# Altium schematic sheet 07_Misc_2.SchDoc: Misc 2 (part 1 of 2)
size A3; Organization: Lime Microsystems; Address1: Surrey Tech Centre; Address2: Guildford GU2 7YG; Address3: Surrey; Address4: United Kingdom; Revision: v1.0; SheetNumber: 7; SheetTotal: 12
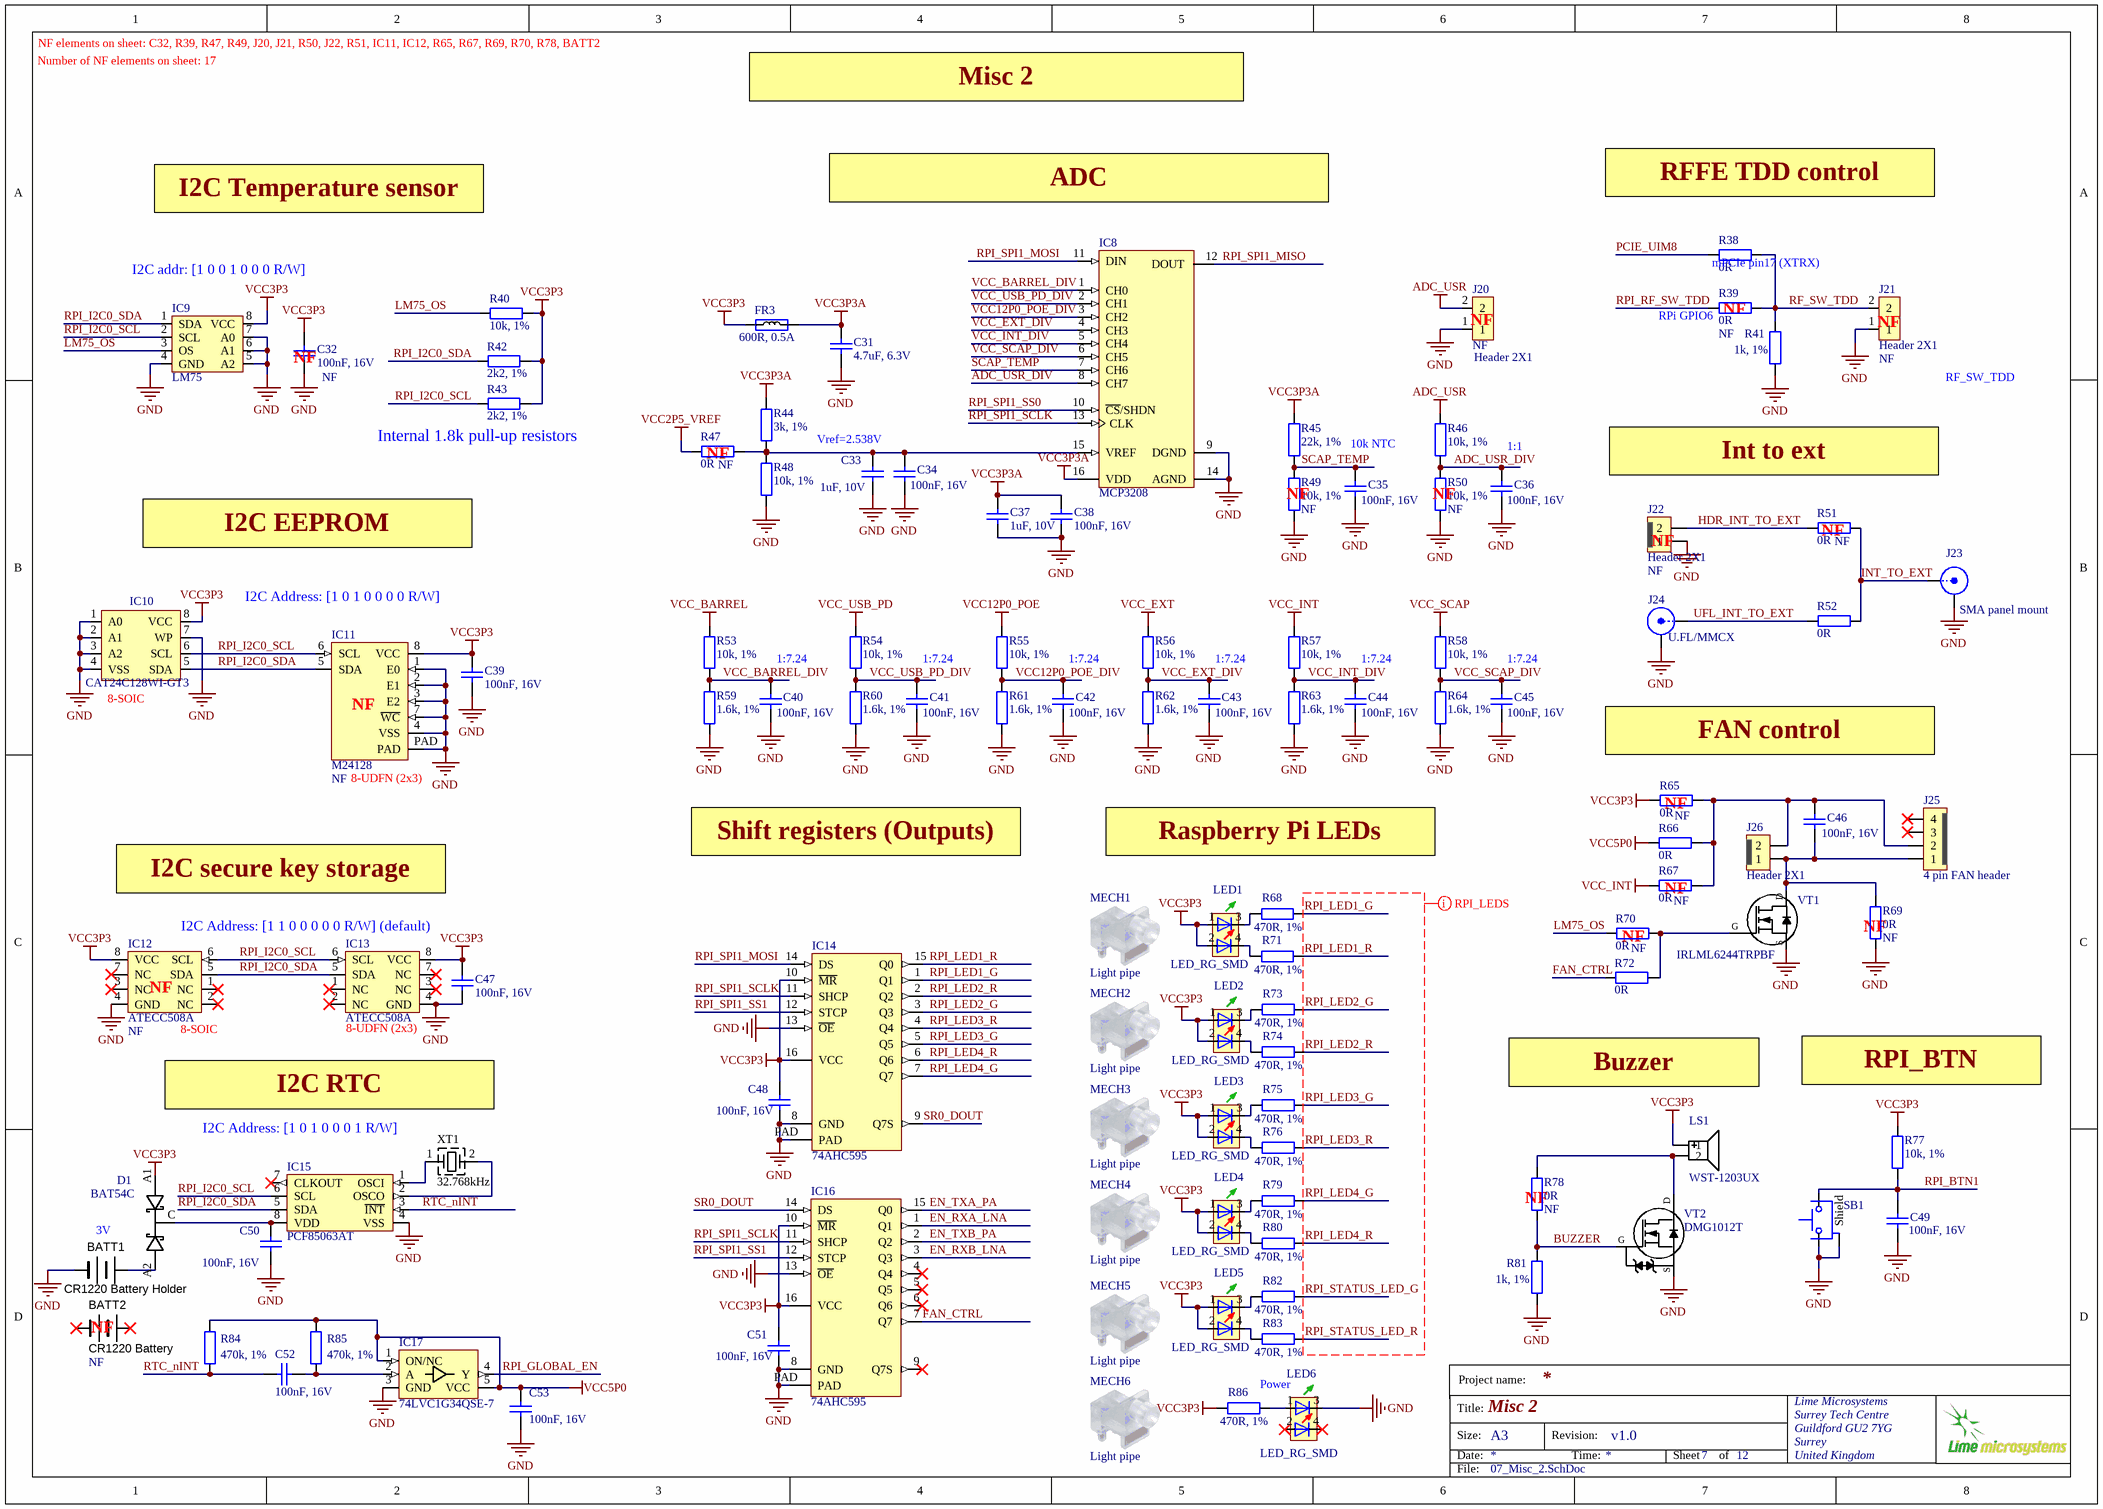
[diagram p0: 07_Misc_2.SchDoc]

## Parts
BATT1  CR1220 Battery Holder  [CR1220_SMD_holder]
BATT2  CR1220 Battery  Assembly Info: NF  (mechanical)
C31  4.7uF, 6.3V  [CAP0402]
C32  100nF, 16V  Assembly Info: NF  [CAP0402]
C33  1uF, 10V  [CAP0402]
C34  100nF, 16V  [CAP0402]
C35  100nF, 16V  [CAP0402]
C36  100nF, 16V  [CAP0402]
C37  1uF, 10V  [CAP0402]
C38  100nF, 16V  [CAP0402]
C39  100nF, 16V  [CAP0402]
C40  100nF, 16V  [CAP0402]
C41  100nF, 16V  [CAP0402]
C42  100nF, 16V  [CAP0402]
C43  100nF, 16V  [CAP0402]
C44  100nF, 16V  [CAP0402]
C45  100nF, 16V  [CAP0402]
C46  100nF, 16V  [CAP0402]
C47  100nF, 16V  [CAP0402]
C48  100nF, 16V  [CAP0402]
C49  100nF, 16V  [CAP0402]
C50  100nF, 16V  [CAP0402]
C51  100nF, 16V  [CAP0402]
C52  100nF, 16V  [CAP0402]
C53  100nF, 16V  [CAP0402]
D1  BAT54C  [BAT54C_SOT23-3]
FR3  600R, 0.5A  [RES0402]
IC8  MCP3208  [MCP3208-CI/SL_SOIC16]
IC9  LM75  [HWSON8_LM75]
IC10  CAT24C128WI-GT3  [SOIC127P600-8DL_v2]
IC11  M24128  Assembly Info: NF  [M24128-DFMC6TG]
IC12  ATECC508A  Assembly Info: NF  [SOIC127P600-8DL_v2]
IC13  ATECC508A  [ATECC508A_UDFN8]
IC14  74AHC595  [74HC595BQ,115]
IC15  PCF85063AT  [PCF85063AT_RTC_SOIC-8]
IC16  74AHC595  [74HC595BQ,115]
IC17  74LVC1G34QSE-7  [74AHCT1G126SE-7_BUFFER_SOT353]
J20  Header 2X1  Assembly Info: NF  [HDR_1x2]
J21  Header 2X1  Assembly Info: NF  [HDR_1x2]
J22  Header 2X1  Assembly Info: NF  [Header1x2_TH_LOCKING]
J23  SMA panel mount  [SMA_connector_side]
J24  U.FL/MMCX  [MMCX_UFL_conn_u]
J25  4 pin FAN header  [Header1x4_TH_LOCKING_v2]
J26  Header 2X1  [Header1x2_TH_LOCKING]
LED1  LED_RG_SMD  [LED-2x0603]
LED2  LED_RG_SMD  [LED-2x0603]
LED3  LED_RG_SMD  [LED-2x0603]
LED4  LED_RG_SMD  [LED-2x0603]
LED5  LED_RG_SMD  [LED-2x0603]
LED6  LED_RG_SMD  [LED-2x0603]
LS1  WST-1203UX  [BUZZER_WST-1203UX]
MECH1  Light pipe  [LIGHT_PIPE_RIGHT_ANGLE_SLP3-200-100-F]
MECH2  Light pipe  [LIGHT_PIPE_RIGHT_ANGLE_SLP3-200-100-F]
MECH3  Light pipe  [LIGHT_PIPE_RIGHT_ANGLE_SLP3-200-100-F]
MECH4  Light pipe  [LIGHT_PIPE_RIGHT_ANGLE_SLP3-200-100-F]
MECH5  Light pipe  [LIGHT_PIPE_RIGHT_ANGLE_SLP3-200-100-F]
MECH6  Light pipe  [LIGHT_PIPE_RIGHT_ANGLE_SLP3-200-100-F]
R38  0R  [RES0402]
R39  0R  Assembly Info: NF  [RES0402]
R40  10k, 1%  [RES0402]
R41  1k, 1%  [RES0402]
R42  2k2, 1%  [RES0402]
R43  2k2, 1%  [RES0402]
R44  3k, 1%  [RES0402]
R45  22k, 1%  [RES0402]
R46  10k, 1%  [RES0402]
R47  0R  Assembly Info: NF  [RES0402_v2]
R48  10k, 1%  [RES0402]
R49  10k, 1%  Assembly Info: NF  [RES0402]
R50  10k, 1%  Assembly Info: NF  [RES0402]
R51  0R  Assembly Info: NF  [RES0402_v2]
R52  0R  [RES0402_v2]
R53  10k, 1%  [RES0402]
R54  10k, 1%  [RES0402]
R55  10k, 1%  [RES0402]
R56  10k, 1%  [RES0402]
R57  10k, 1%  [RES0402]
R58  10k, 1%  [RES0402]
R59  1.6k, 1%  [RES0402]
R60  1.6k, 1%  [RES0402]
R61  1.6k, 1%  [RES0402]
R62  1.6k, 1%  [RES0402]
R63  1.6k, 1%  [RES0402]
R64  1.6k, 1%  [RES0402]
R65  0R  Assembly Info: NF  [RES0402]
R66  0R  [RES0402]
R67  0R  Assembly Info: NF  [RES0402]
R68  470R, 1%  [RES0402]
R69  0R  Assembly Info: NF  [RES0402]
R70  0R  Assembly Info: NF  [RES0402]
R71  470R, 1%  [RES0402]
R72  0R  [RES0402]
R73  470R, 1%  [RES0402]
R74  470R, 1%  [RES0402]
R75  470R, 1%  [RES0402]
R76  470R, 1%  [RES0402]
R77  10k, 1%  [RES0402]
R78  0R  Assembly Info: NF  [RES0402]
R79  470R, 1%  [RES0402]
R80  470R, 1%  [RES0402]
R81  1k, 1%  [RES0402]
R82  470R, 1%  [RES0402]
R83  470R, 1%  [RES0402]
R84  470k, 1%  [RES0402]
R85  470k, 1%  [RES0402]
R86  470R, 1%  [RES0402]
SB1  Switch tactile right edge  [SW_TACTILE_RIGHT_EDGE]  (value not drawn)
VT1  IRLML6244TRPBF  [SOT23-3]
VT2  DMG1012T  [SOT523]
XT1  32.768kHz  [CRYSTAL_2PIN_RTC_RT3215]

## Nets
ADC_USR: J20.2 R46.1
GND: BATT1.NEGATIVE C31.1 C32.2 C33.1 C34.2 C35.2 C36.2 C37.1 C38.1 C39.2 C40.2 C41.2 C42.2 C43.2 C44.2 C45.2 C47.2 C48.1 C49.2 C50.2 C51.1 C53.2 IC8.9(DGND) IC8.14(AGND) IC9.4(GND) IC9.5(A2) IC9.6(A1) IC9.7(A0) IC10.1(A0) IC10.2(A1) IC10.3(A2) IC10.4(VSS) IC10.7(WP) IC11.1(E0) IC11.2(E1) IC11.3(E2) IC11.4(VSS) IC11.7(~{WC}) IC11.PAD IC12.4(GND) IC13.4(GND) IC14.8(GND) IC14.13(~{OE}) IC14.PAD IC15.4(VSS) IC16.8(GND) IC16.13(~{OE}) IC16.PAD IC17.3(GND) J20.1 J21.1 J22.1 J23.2(Y) J24.2(Y) LED6.3 R41.2 R48.2 R49.2 R50.2 R59.1 R60.1 R61.1 R62.1 R63.1 R64.1 R69.1 R81.2 SB1.2 SB1.Shield VT1.S VT2.S
VCC2P5_VREF: R47.1
VCC3P3: C32.1 C39.1 C47.1 C48.2 C51.2 D1.A1 FR3.1 IC9.8(VCC) IC10.8(VCC) IC11.8(VCC) IC12.8(VCC) IC13.8(VCC) IC14.10(~{MR}) IC14.16(VCC) IC16.10(~{MR}) IC16.16(VCC) LED1.1 LED1.2 LED2.1 LED2.2 LED3.1 LED3.2 LED4.1 LED4.2 LED5.1 LED5.2 LS1.1 R40.2 R42.2 R43.2 R65.1 R77.1 R86.2
VCC3P3A: C31.2 C37.2 C38.2 FR3.2 IC8.16(VDD) R44.2 R45.1
VCC5P0: C53.1 IC17.1(ON/NC) IC17.5(VCC) R66.1 R84.2 R85.2
VCC12P0_POE: R55.1
VCC_BARREL: R53.1
VCC_EXT: R56.1
VCC_INT: R57.1 R67.1
VCC_SCAP: R58.1
VCC_USB_PD: R54.1
ADC_USR_DIV: C36.1 IC8.8(CH7) R46.2 R50.1
BUZZER: R78.1 R81.1 VT2.G
EN_RXA_LNA: IC16.1(Q1)
EN_RXB_LNA: IC16.3(Q3)
EN_TXA_PA: IC16.15(Q0)
EN_TXB_PA: IC16.2(Q2)
FAN_CTRL: IC16.7(Q7) R72.1
HDR_INT_TO_EXT: J22.2 R51.2
INT_TO_EXT: J23.1(X) R51.1 R52.1
LM75_OS: IC9.3(OS) R40.1 R70.1
PCIE_UIM8: R38.2
RF_SW_TDD: J21.2 R38.1 R39.1 R41.1
RPI_BTN1: C49.1 R77.2 SB1.1
RPI_GLOBAL_EN: IC17.4(Y)
RPI_I2C0_SCL: IC9.2(SCL) IC10.6(SCL) IC11.6(SCL) IC12.6(SCL) IC13.6(SCL) IC15.6(SCL) R43.1
RPI_I2C0_SDA: IC9.1(SDA) IC10.5(SDA) IC11.5(SDA) IC12.5(SDA) IC13.5(SDA) IC15.5(SDA) R42.1
RPI_LED1_G: IC14.1(Q1) R68.1
RPI_LED1_R: IC14.15(Q0) R71.1
RPI_LED2_G: IC14.3(Q3) R73.1
RPI_LED2_R: IC14.2(Q2) R74.1
RPI_LED3_G: IC14.5(Q5) R75.1
RPI_LED3_R: IC14.4(Q4) R76.1
RPI_LED4_G: IC14.7(Q7) R79.1
RPI_LED4_R: IC14.6(Q6) R80.1
RPI_RF_SW_TDD: R39.2
RPI_SPI1_MISO: IC8.12(DOUT)
RPI_SPI1_MOSI: IC8.11(DIN) IC14.14(DS)
RPI_SPI1_SCLK: IC8.13(CLK) IC14.11(SHCP) IC16.11(SHCP)
RPI_SPI1_SS0: IC8.10(~{CS}/SHDN)
RPI_SPI1_SS1: IC14.12(STCP) IC16.12(STCP)
RPI_STATUS_LED_G: R82.1
RPI_STATUS_LED_R: R83.1
RTC_nINT: C52.1 IC15.3(~{INT}) R84.1
SCAP_TEMP: C35.1 IC8.7(CH6) R45.2 R49.1
SR0_DOUT: IC14.9(Q7S) IC16.14(DS)
UFL_INT_TO_EXT: J24.1(X) R52.2
VCC12P0_POE_DIV: C42.1 IC8.3(CH2) R55.2 R61.2
VCC_BARREL_DIV: C40.1 IC8.1(CH0) R53.2 R59.2
VCC_EXT_DIV: C43.1 IC8.4(CH3) R56.2 R62.2
VCC_INT_DIV: C44.1 IC8.5(CH4) R57.2 R63.2
VCC_SCAP_DIV: C45.1 IC8.6(CH5) R58.2 R64.2
VCC_USB_PD_DIV: C41.1 IC8.2(CH1) R54.2 R60.2
NetBATT1_POSITIVE: BATT1.POSITIVE D1.A2
NetC33_2: C33.2 C34.1 IC8.15(VREF) R44.1 R47.2 R48.1
NetC46_1: C46.1 J25.2 J26.2 R65.2 R66.2 R67.2
NetC46_2: C46.2 J25.1 J26.1 R69.2 VT1.D
NetC50_1: C50.1 D1.C IC15.8(VDD)
NetC52_2: C52.2 IC17.2(A) R85.1
NetIC15_1: IC15.1(OSCI) XT1.1(X)
NetIC15_2: IC15.2(OSCO) XT1.2(X)
NetLED1_3: LED1.3 R68.2
NetLED1_4: LED1.4 R71.2
NetLED2_3: LED2.3 R73.2
NetLED2_4: LED2.4 R74.2
NetLED3_3: LED3.3 R75.2
NetLED3_4: LED3.4 R76.2
NetLED4_3: LED4.3 R79.2
NetLED4_4: LED4.4 R80.2
NetLED5_3: LED5.3 R82.2
NetLED5_4: LED5.4 R83.2
NetLED6_1: LED6.1 R86.1
NetLS1_2: LS1.2 R78.2 VT2.D
NetR70_2: R70.2 R72.2 VT1.G

Not connected (* = marked no-connect by the designer): BATT2 NEGATIVE* POSITIVE*; IC12 1(NC)* 2(NC)* 3(NC)* 7(NC)*; IC13 1(NC)* 2(NC)* 3(NC)* 7(NC)*; IC15 7(CLKOUT)*; IC16 4(Q4)* 5(Q5)* 6(Q6)* 9(Q7S)*; J25 3* 4*; LED6 2* 4*

## Layout directives
net class RPI_LEDS: RPI_LED1_G, RPI_LED1_R, RPI_LED2_G, RPI_LED2_R, RPI_LED3_G, RPI_LED3_R, RPI_LED4_G, RPI_LED4_R, RPI_STATUS_LED_G, RPI_STATUS_LED_R

## Notes on the sheet
- NF elements on sheet: C32, R39, R47, R49, J20, J21, R50, J22, R51, IC11, IC12, R65, R67, R69, R70, R78, BATT2
- Number of NF elements on sheet: 17
- Misc 2
- I2C Temperature sensor
- ADC
- RFFE TDD control
- I2C addr: [1 0 0 1 0 0 0 R/W]
- (near R38) mPCIe pin17 (XTRX)
- (near R39) NF
- (near C32) NF
- (near J20) NF
- RPi GPIO6
- (near J21) NF
- (near J21) RF_SW_TDD
- (near R43) Internal 1.8k pull-up resistors
- Vref=2.538V
- 10k NTC
- (near C36) 1:1
- (near R47) NF
- (near R49) NF
- (near R50) NF
- Int to ext
- I2C EEPROM
- (near J22) NF
- (near R51) NF
- I2C Address: [1 0 1 0 0 0 0 R/W]
- (near IC10) 8-SOIC
- (near IC11) NF
- 1:7.24
- (near C45) 1:7.24
- (near IC11) 8-UDFN (2x3)
- FAN control
- Shift registers (Outputs)
- Raspberry Pi LEDs
- (near R65) NF
- I2C secure key storage
- (near R67) NF
- (near IC12) NF
- I2C Address: [1 1 0 0 0 0 0 R/W] (default)
- (near R70) NF
- (near R69) NF
- (near IC12) 8-SOIC
- (near IC13) 8-UDFN (2x3)
- I2C RTC
- Buzzer
- (near R77) RPI_BTN
- (near XT1) I2C Address: [1 0 1 0 0 0 1 R/W]
- 3V
- (near R78) NF
- (near BATT2) NF
- Power
- Project name:
- Title:
- Size:
- Date:
- A3
- Revision:
- Time:
- Sheet
- of
- File: